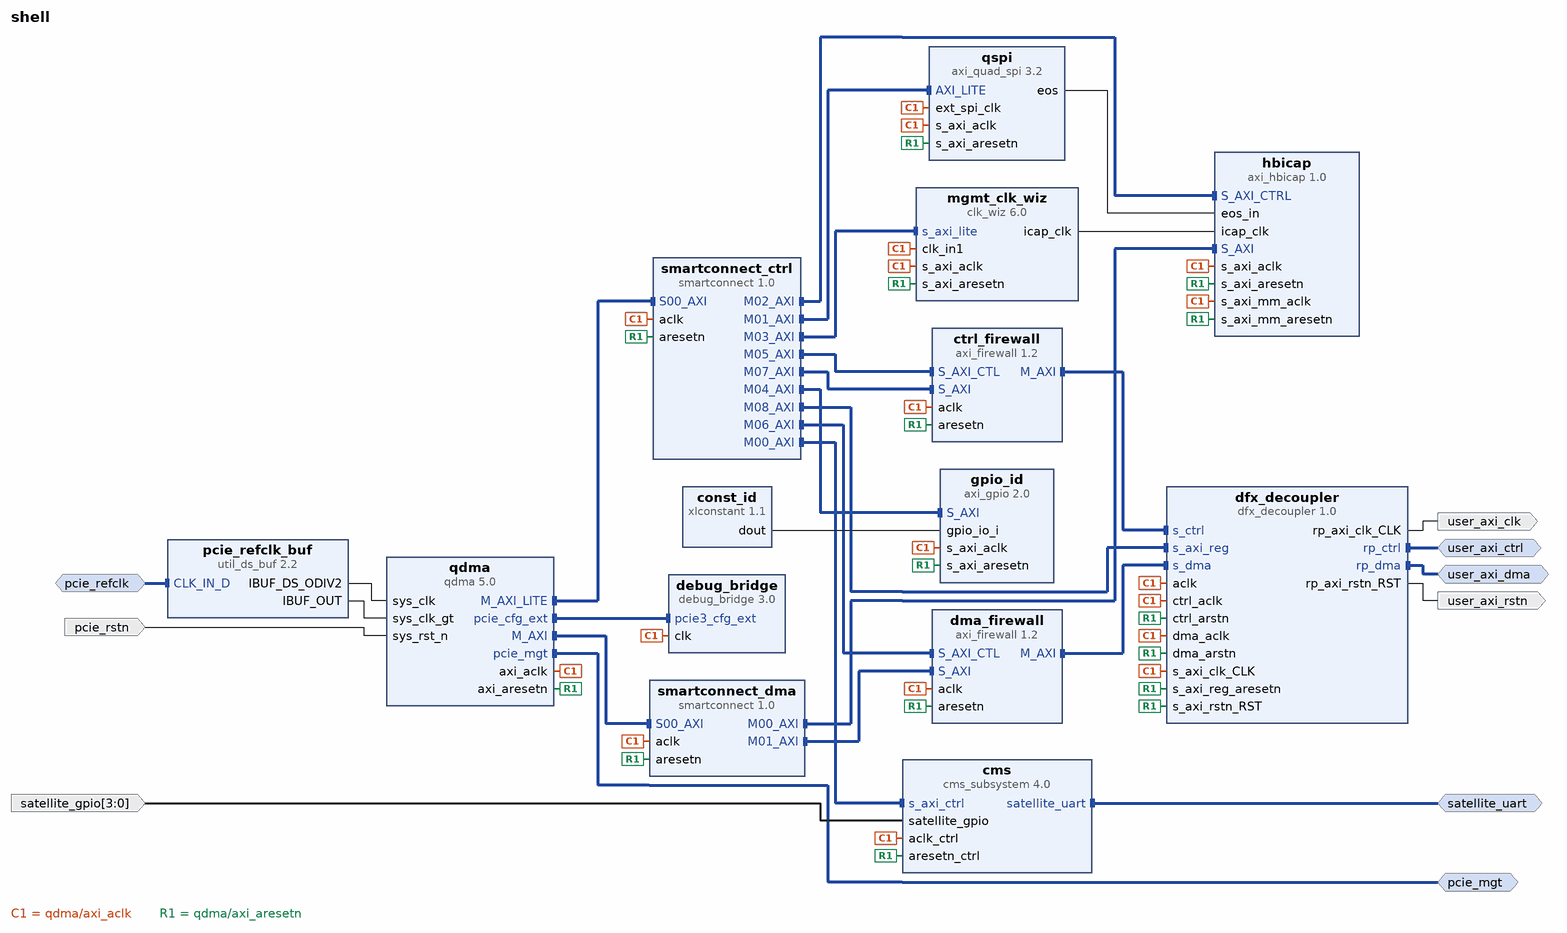
[diagram p0: block diagram of the top level]
# Vivado block design shell, xcu55n-fsvh2892-2L-e, Vivado 2022.2
create_bd_design shell

create_bd_intf_port -mode Master -vlnv xilinx.com:interface:pcie_7x_mgt_rtl:1.0 pcie_mgt
create_bd_intf_port -mode Slave -vlnv xilinx.com:interface:diff_clock_rtl:1.0 pcie_refclk
create_bd_intf_port -mode Master -vlnv xilinx.com:interface:uart_rtl:1.0 satellite_uart
create_bd_intf_port -mode Master -vlnv xilinx.com:interface:aximm_rtl:1.0 user_axi_ctrl
set_property -dict [list \
  CONFIG.ADDR_WIDTH 32 \
  CONFIG.DATA_WIDTH 32 \
  CONFIG.FREQ_HZ 250000000 \
  CONFIG.HAS_BURST 0 \
  CONFIG.HAS_CACHE 0 \
  CONFIG.HAS_LOCK 0 \
  CONFIG.HAS_PROT 0 \
  CONFIG.HAS_QOS 0 \
  CONFIG.HAS_REGION 0 \
  CONFIG.PROTOCOL AXI4LITE \
] [get_bd_intf_ports user_axi_ctrl]
create_bd_intf_port -mode Master -vlnv xilinx.com:interface:aximm_rtl:1.0 user_axi_dma
set_property -dict [list \
  CONFIG.ADDR_WIDTH 64 \
  CONFIG.DATA_WIDTH 128 \
  CONFIG.FREQ_HZ 250000000 \
  CONFIG.HAS_REGION 0 \
  CONFIG.NUM_READ_OUTSTANDING 32 \
  CONFIG.NUM_WRITE_OUTSTANDING 32 \
  CONFIG.PROTOCOL AXI4 \
] [get_bd_intf_ports user_axi_dma]
create_bd_port -dir I -type rst pcie_rstn
create_bd_port -dir I -from 3 -to 0 -type intr satellite_gpio
set_property -dict {CONFIG.PortWidth 4 CONFIG.SENSITIVITY EDGE_RISING} [get_bd_ports satellite_gpio]
create_bd_port -dir O -type clk user_axi_clk
set_property -dict {CONFIG.ASSOCIATED_RESET user_axi_rstn} [get_bd_ports user_axi_clk]
create_bd_port -dir O -type rst user_axi_rstn

create_bd_cell -type ip -vlnv xilinx.com:ip:cms_subsystem:4.0 cms
create_bd_cell -type ip -vlnv xilinx.com:ip:util_ds_buf:2.2 pcie_refclk_buf
set_property -dict {CONFIG.C_BUF_TYPE IBUFDSGTE} [get_bd_cells pcie_refclk_buf]
create_bd_cell -type ip -vlnv xilinx.com:ip:axi_quad_spi:3.2 qspi
set_property -dict [list \
  CONFIG.C_FIFO_DEPTH 256 \
  CONFIG.C_SPI_MEMORY 2 \
  CONFIG.C_SPI_MODE 2 \
  CONFIG.C_USE_STARTUP 1 \
  CONFIG.C_USE_STARTUP_INT 1 \
] [get_bd_cells qspi]
create_bd_cell -type ip -vlnv xilinx.com:ip:axi_hbicap:1.0 hbicap
set_property -dict {CONFIG.C_READ_PATH 0 CONFIG.C_WRITE_FIFO_DEPTH 1024} [get_bd_cells hbicap]
create_bd_cell -type ip -vlnv xilinx.com:ip:clk_wiz:6.0 mgmt_clk_wiz
set_property -dict [list \
  CONFIG.AUTO_PRIMITIVE MMCM \
  CONFIG.CLKOUT1_DRIVES Buffer \
  CONFIG.CLKOUT1_JITTER 106.624 \
  CONFIG.CLKOUT1_PHASE_ERROR 85.285 \
  CONFIG.CLKOUT1_REQUESTED_OUT_FREQ 125 \
  CONFIG.CLKOUT2_DRIVES Buffer \
  CONFIG.CLKOUT3_DRIVES Buffer \
  CONFIG.CLKOUT4_DRIVES Buffer \
  CONFIG.CLKOUT5_DRIVES Buffer \
  CONFIG.CLKOUT6_DRIVES Buffer \
  CONFIG.CLKOUT7_DRIVES Buffer \
  CONFIG.CLK_OUT1_PORT icap_clk \
  CONFIG.FEEDBACK_SOURCE FDBK_AUTO \
  CONFIG.MMCM_BANDWIDTH OPTIMIZED \
  CONFIG.MMCM_CLKFBOUT_MULT_F 9.625 \
  CONFIG.MMCM_CLKOUT0_DIVIDE_F 9.625 \
  CONFIG.MMCM_COMPENSATION AUTO \
  CONFIG.MMCM_DIVCLK_DIVIDE 2 \
  CONFIG.OPTIMIZE_CLOCKING_STRUCTURE_EN false \
  CONFIG.PRIMITIVE MMCM \
  CONFIG.PRIM_SOURCE Global_buffer \
  CONFIG.RESET_PORT reset \
  CONFIG.RESET_TYPE ACTIVE_HIGH \
  CONFIG.USE_DYN_RECONFIG true \
  CONFIG.USE_LOCKED true \
  CONFIG.USE_RESET true \
] [get_bd_cells mgmt_clk_wiz]
create_bd_cell -type ip -vlnv xilinx.com:ip:axi_gpio:2.0 gpio_id
set_property -dict {CONFIG.C_ALL_INPUTS 1 CONFIG.C_IS_DUAL 0} [get_bd_cells gpio_id]
create_bd_cell -type ip -vlnv xilinx.com:ip:xlconstant:1.1 const_id
set_property -dict {CONFIG.CONST_VAL 0xDEADBEEF CONFIG.CONST_WIDTH 32} [get_bd_cells const_id]
create_bd_cell -type ip -vlnv xilinx.com:ip:smartconnect:1.0 smartconnect_ctrl
set_property -dict {CONFIG.NUM_MI 9 CONFIG.NUM_SI 1} [get_bd_cells smartconnect_ctrl]
create_bd_cell -type ip -vlnv xilinx.com:ip:smartconnect:1.0 smartconnect_dma
set_property -dict {CONFIG.NUM_MI 2 CONFIG.NUM_SI 1} [get_bd_cells smartconnect_dma]
create_bd_cell -type ip -vlnv xilinx.com:ip:debug_bridge:3.0 debug_bridge
set_property -dict {CONFIG.C_DEBUG_MODE 5 CONFIG.C_DESIGN_TYPE 0} [get_bd_cells debug_bridge]
create_bd_cell -type ip -vlnv xilinx.com:ip:axi_firewall:1.2 dma_firewall
set_property -dict [list \
  CONFIG.ADDR_WIDTH 64 \
  CONFIG.ARUSER_WIDTH 0 \
  CONFIG.AWUSER_WIDTH 0 \
  CONFIG.BUSER_WIDTH 0 \
  CONFIG.DATA_WIDTH 128 \
  CONFIG.HAS_BRESP 1 \
  CONFIG.HAS_BURST 0 \
  CONFIG.HAS_CACHE 0 \
  CONFIG.HAS_LOCK 0 \
  CONFIG.HAS_PROT 0 \
  CONFIG.HAS_QOS 0 \
  CONFIG.HAS_REGION 0 \
  CONFIG.HAS_RRESP 1 \
  CONFIG.HAS_WSTRB 1 \
  CONFIG.ID_WIDTH 0 \
  CONFIG.PROTOCOL AXI4 \
  CONFIG.READ_WRITE_MODE READ_WRITE \
  CONFIG.RUSER_WIDTH 0 \
  CONFIG.SUPPORTS_NARROW 0 \
  CONFIG.WUSER_WIDTH 0 \
] [get_bd_cells dma_firewall]
create_bd_cell -type ip -vlnv xilinx.com:ip:axi_firewall:1.2 ctrl_firewall
set_property -dict [list \
  CONFIG.ADDR_WIDTH 32 \
  CONFIG.DATA_WIDTH 32 \
  CONFIG.HAS_BRESP 1 \
  CONFIG.HAS_BURST 0 \
  CONFIG.HAS_CACHE 0 \
  CONFIG.HAS_LOCK 0 \
  CONFIG.HAS_PROT 0 \
  CONFIG.HAS_QOS 0 \
  CONFIG.HAS_REGION 0 \
  CONFIG.HAS_RRESP 1 \
  CONFIG.HAS_WSTRB 1 \
  CONFIG.PROTOCOL AXI4LITE \
  CONFIG.READ_WRITE_MODE READ_WRITE \
  CONFIG.SUPPORTS_NARROW 0 \
] [get_bd_cells ctrl_firewall]
create_bd_cell -type ip -vlnv xilinx.com:ip:qdma:5.0 qdma
set_property -dict [list \
  CONFIG.cfg_ext_if true \
  CONFIG.copy_pf0 true \
  CONFIG.mcap_enablement DFX_over_PCIe \
  CONFIG.mode_selection Advanced \
  CONFIG.num_queues 512 \
  CONFIG.pf0_Use_Class_Code_Lookup_Assistant_qdma true \
  CONFIG.pf0_bar2_scale_qdma Megabytes \
  CONFIG.pf0_bar2_size_qdma 128 \
  CONFIG.pf0_base_class_menu_qdma Processing_accelerators \
  CONFIG.pf1_Use_Class_Code_Lookup_Assistant_qdma true \
  CONFIG.pf1_base_class_menu_qdma Processing_accelerators \
  CONFIG.pl_link_cap_max_link_speed 8.0_GT/s \
  CONFIG.pl_link_cap_max_link_width X4 \
  CONFIG.tl_pf_enable_reg 1 \
] [get_bd_cells qdma]
create_bd_cell -type ip -vlnv xilinx.com:ip:dfx_decoupler:1.0 dfx_decoupler
set_property -dict [list \
  CONFIG.ALL_PARAMS {['HAS_AXI_LITE 1', 'HAS_SIGNAL_CONTROL 0', 'HAS_SIGNAL_STATUS 1', 'ALWAYS_HAVE_AXI_CLK 1', 'INTF {', 'ctrl {ID 0 MODE slave VLNV xilinx.com:interface:aximm_rtl:1.0 PROTOCOL AXI4LITE SIGNALS {ARVALID {PRESENT 1 WIDTH 1} ARREADY {PRESENT 1 WIDTH 1} AWVALID {PRESENT 1 WIDTH 1} AWREADY {PRESENT 1 WIDTH 1}', 'BVALID {PRESENT 1 WIDTH 1} BREADY {PRESENT 1 WIDTH 1} RVALID {PRESENT 1 WIDTH 1} RREADY {PRESENT 1 WIDTH 1} WVALID {PRESENT 1 WIDTH 1} WREADY {PRESENT 1 WIDTH 1} AWADDR {PRESENT 1 WIDTH 32} AWLEN', '{PRESENT 0 WIDTH 8} AWSIZE {PRESENT 0 WIDTH 3} AWBURST {PRESENT 0 WIDTH 2} AWLOCK {PRESENT 0 WIDTH 1} AWCACHE {PRESENT 0 WIDTH 4} AWPROT {PRESENT 0 WIDTH 3} WDATA {PRESENT 1 WIDTH 32} WSTRB {PRESENT 1', 'WIDTH 4} WLAST {PRESENT 0 WIDTH 1} BRESP {PRESENT 1 WIDTH 2} ARADDR {PRESENT 1 WIDTH 32} ARLEN {PRESENT 0 WIDTH 8} ARSIZE {PRESENT 0 WIDTH 3} ARBURST {PRESENT 0 WIDTH 2} ARLOCK {PRESENT 0 WIDTH 1}', 'ARCACHE {PRESENT 0 WIDTH 4} ARPROT {PRESENT 0 WIDTH 3} RDATA {PRESENT 1 WIDTH 32} RRESP {PRESENT 1 WIDTH 2} RLAST {PRESENT 0 WIDTH 1} AWID {WIDTH 0 PRESENT 0} AWREGION {WIDTH 4 PRESENT 0} AWQOS {WIDTH', '4 PRESENT 0} AWUSER {WIDTH 0 PRESENT 0} WID {WIDTH 0 PRESENT 0} WUSER {WIDTH 0 PRESENT 0} BID {WIDTH 0 PRESENT 0} BUSER {WIDTH 0 PRESENT 0} ARID {WIDTH 0 PRESENT 0} ARREGION {WIDTH 4 PRESENT 0} ARQOS', '{WIDTH 4 PRESENT 0} ARUSER {WIDTH 0 PRESENT 0} RID {WIDTH 0 PRESENT 0} RUSER {WIDTH 0 PRESENT 0}}} dma {ID 1 MODE slave VLNV xilinx.com:interface:aximm_rtl:1.0 PROTOCOL AXI4 SIGNALS {ARVALID {WIDTH 1', 'PRESENT 1} ARREADY {WIDTH 1 PRESENT 1} AWVALID {WIDTH 1 PRESENT 1} AWREADY {WIDTH 1 PRESENT 1} BVALID {WIDTH 1 PRESENT 1} BREADY {WIDTH 1 PRESENT 1} RVALID {WIDTH 1 PRESENT 1} RREADY {WIDTH 1 PRESENT', '1} WVALID {WIDTH 1 PRESENT 1} WREADY {WIDTH 1 PRESENT 1} AWID {WIDTH 0 PRESENT 0} AWADDR {WIDTH 64 PRESENT 1} AWLEN {WIDTH 8 PRESENT 1} AWSIZE {WIDTH 3 PRESENT 1} AWBURST {WIDTH 2 PRESENT 0} AWLOCK', '{WIDTH 1 PRESENT 0} AWCACHE {WIDTH 4 PRESENT 0} AWPROT {WIDTH 3 PRESENT 0} AWREGION {WIDTH 4 PRESENT 0} AWQOS {WIDTH 4 PRESENT 0} AWUSER {WIDTH 0 PRESENT 0} WID {WIDTH 0 PRESENT 0} WDATA {WIDTH 128', 'PRESENT 1} WSTRB {WIDTH 16 PRESENT 1} WLAST {WIDTH 1 PRESENT 1} WUSER {WIDTH 0 PRESENT 0} BID {WIDTH 0 PRESENT 0} BRESP {WIDTH 2 PRESENT 1} BUSER {WIDTH 0 PRESENT 0} ARID {WIDTH 0 PRESENT 0} ARADDR', '{WIDTH 64 PRESENT 1} ARLEN {WIDTH 8 PRESENT 1} ARSIZE {WIDTH 3 PRESENT 1} ARBURST {WIDTH 2 PRESENT 0} ARLOCK {WIDTH 1 PRESENT 0} ARCACHE {WIDTH 4 PRESENT 0} ARPROT {WIDTH 3 PRESENT 0} ARREGION {WIDTH', '4 PRESENT 0} ARQOS {WIDTH 4 PRESENT 0} ARUSER {WIDTH 0 PRESENT 0} RID {WIDTH 0 PRESENT 0} RDATA {WIDTH 128 PRESENT 1} RRESP {WIDTH 2 PRESENT 1} RLAST {WIDTH 1 PRESENT 1} RUSER {WIDTH 0 PRESENT 0}}}', 'axi_clk {ID 2 VLNV xilinx.com:signal:clock_rtl:1.0 MODE slave SIGNALS {CLK {PRESENT 1 WIDTH 1}}} axi_rstn {ID 3 VLNV xilinx.com:signal:reset_rtl:1.0 MODE slave SIGNALS {RST {PRESENT 1 WIDTH 1}}}', '}', 'IPI_PROP_COUNT 3']} \
  CONFIG.GUI_INTERFACE_NAME ctrl \
  CONFIG.GUI_SELECT_MODE slave \
  CONFIG.GUI_SELECT_VLNV xilinx.com:interface:aximm_rtl:1.0 \
] [get_bd_cells dfx_decoupler]

# ---- connections ----

connect_bd_intf_net -intf_net CLK_IN_D_0_1 [get_bd_intf_ports pcie_refclk] [get_bd_intf_pins pcie_refclk_buf/CLK_IN_D]
connect_bd_intf_net [get_bd_intf_ports satellite_uart] [get_bd_intf_pins cms/satellite_uart]
connect_bd_intf_net [get_bd_intf_pins dfx_decoupler/s_ctrl] [get_bd_intf_pins ctrl_firewall/M_AXI]
connect_bd_intf_net [get_bd_intf_ports user_axi_ctrl] [get_bd_intf_pins dfx_decoupler/rp_ctrl]
connect_bd_intf_net [get_bd_intf_ports user_axi_dma] [get_bd_intf_pins dfx_decoupler/rp_dma]
connect_bd_intf_net [get_bd_intf_pins dfx_decoupler/s_dma] [get_bd_intf_pins dma_firewall/M_AXI]
connect_bd_intf_net [get_bd_intf_pins qdma/M_AXI] [get_bd_intf_pins smartconnect_dma/S00_AXI]
connect_bd_intf_net [get_bd_intf_pins qdma/M_AXI_LITE] [get_bd_intf_pins smartconnect_ctrl/S00_AXI]
connect_bd_intf_net [get_bd_intf_pins debug_bridge/pcie3_cfg_ext] [get_bd_intf_pins qdma/pcie_cfg_ext]
connect_bd_intf_net [get_bd_intf_ports pcie_mgt] [get_bd_intf_pins qdma/pcie_mgt]
connect_bd_intf_net [get_bd_intf_pins smartconnect_ctrl/M00_AXI] [get_bd_intf_pins cms/s_axi_ctrl]
connect_bd_intf_net [get_bd_intf_pins smartconnect_ctrl/M01_AXI] [get_bd_intf_pins qspi/AXI_LITE]
connect_bd_intf_net [get_bd_intf_pins smartconnect_ctrl/M02_AXI] [get_bd_intf_pins hbicap/S_AXI_CTRL]
connect_bd_intf_net [get_bd_intf_pins smartconnect_ctrl/M03_AXI] [get_bd_intf_pins mgmt_clk_wiz/s_axi_lite]
connect_bd_intf_net [get_bd_intf_pins smartconnect_ctrl/M04_AXI] [get_bd_intf_pins gpio_id/S_AXI]
connect_bd_intf_net [get_bd_intf_pins ctrl_firewall/S_AXI_CTL] [get_bd_intf_pins smartconnect_ctrl/M05_AXI]
connect_bd_intf_net [get_bd_intf_pins dma_firewall/S_AXI_CTL] [get_bd_intf_pins smartconnect_ctrl/M06_AXI]
connect_bd_intf_net [get_bd_intf_pins smartconnect_ctrl/M07_AXI] [get_bd_intf_pins ctrl_firewall/S_AXI]
connect_bd_intf_net [get_bd_intf_pins smartconnect_ctrl/M08_AXI] [get_bd_intf_pins dfx_decoupler/s_axi_reg]
connect_bd_intf_net [get_bd_intf_pins smartconnect_dma/M00_AXI] [get_bd_intf_pins hbicap/S_AXI]
connect_bd_intf_net [get_bd_intf_pins dma_firewall/S_AXI] [get_bd_intf_pins smartconnect_dma/M01_AXI]
connect_bd_net [get_bd_pins const_id/dout] [get_bd_pins gpio_id/gpio_io_i]
connect_bd_net [get_bd_pins dfx_decoupler/rp_axi_clk_CLK] [get_bd_ports user_axi_clk]
connect_bd_net [get_bd_pins dfx_decoupler/rp_axi_rstn_RST] [get_bd_ports user_axi_rstn]
connect_bd_net [get_bd_pins mgmt_clk_wiz/icap_clk] [get_bd_pins hbicap/icap_clk]
connect_bd_net -net pcie_ref_clk_buf_IBUF_DS_ODIV2 [get_bd_pins pcie_refclk_buf/IBUF_DS_ODIV2] [get_bd_pins qdma/sys_clk]
connect_bd_net -net pcie_ref_clk_buf_IBUF_OUT [get_bd_pins pcie_refclk_buf/IBUF_OUT] [get_bd_pins qdma/sys_clk_gt]
connect_bd_net [get_bd_ports pcie_rstn] [get_bd_pins qdma/sys_rst_n]
connect_bd_net [get_bd_pins qspi/eos] [get_bd_pins hbicap/eos_in]
connect_bd_net -net satellite_gpio_0_1 [get_bd_ports satellite_gpio] [get_bd_pins cms/satellite_gpio]
connect_bd_net -net xdma_axi_aclk [get_bd_pins qdma/axi_aclk] \
  [get_bd_pins cms/aclk_ctrl] [get_bd_pins qspi/ext_spi_clk] [get_bd_pins qspi/s_axi_aclk] [get_bd_pins mgmt_clk_wiz/clk_in1] \
  [get_bd_pins hbicap/s_axi_aclk] [get_bd_pins hbicap/s_axi_mm_aclk] [get_bd_pins mgmt_clk_wiz/s_axi_aclk] \
  [get_bd_pins gpio_id/s_axi_aclk] [get_bd_pins smartconnect_ctrl/aclk] [get_bd_pins smartconnect_dma/aclk] \
  [get_bd_pins debug_bridge/clk] [get_bd_pins ctrl_firewall/aclk] [get_bd_pins dfx_decoupler/aclk] \
  [get_bd_pins dma_firewall/aclk] [get_bd_pins dfx_decoupler/ctrl_aclk] [get_bd_pins dfx_decoupler/dma_aclk] \
  [get_bd_pins dfx_decoupler/s_axi_clk_CLK]
connect_bd_net -net xdma_axi_aresetn [get_bd_pins qdma/axi_aresetn] \
  [get_bd_pins cms/aresetn_ctrl] [get_bd_pins qspi/s_axi_aresetn] [get_bd_pins hbicap/s_axi_aresetn] \
  [get_bd_pins hbicap/s_axi_mm_aresetn] [get_bd_pins mgmt_clk_wiz/s_axi_aresetn] [get_bd_pins gpio_id/s_axi_aresetn] \
  [get_bd_pins smartconnect_ctrl/aresetn] [get_bd_pins smartconnect_dma/aresetn] [get_bd_pins ctrl_firewall/aresetn] \
  [get_bd_pins dfx_decoupler/s_axi_reg_aresetn] [get_bd_pins dma_firewall/aresetn] [get_bd_pins dfx_decoupler/ctrl_arstn] \
  [get_bd_pins dfx_decoupler/dma_arstn] [get_bd_pins dfx_decoupler/s_axi_rstn_RST]

# ---- address map ----
assign_bd_address -offset 0x0000000000000000 -range 256T -target_address_space [get_bd_addr_spaces qdma/M_AXI] [get_bd_addr_segs user_axi_dma/Reg]
assign_bd_address -offset 0xF000000000000000 -range 1G -target_address_space [get_bd_addr_spaces qdma/M_AXI] [get_bd_addr_segs hbicap/S_AXI/Mem0]
assign_bd_address -offset 0x00000000 -range 256K -target_address_space [get_bd_addr_spaces qdma/M_AXI_LITE] [get_bd_addr_segs cms/s_axi_ctrl/Mem]
assign_bd_address -offset 0x00040000 -range 64K -target_address_space [get_bd_addr_spaces qdma/M_AXI_LITE] [get_bd_addr_segs gpio_id/S_AXI/Reg]
assign_bd_address -offset 0x00050000 -range 64K -target_address_space [get_bd_addr_spaces qdma/M_AXI_LITE] [get_bd_addr_segs hbicap/S_AXI_CTRL/Reg0]
assign_bd_address -offset 0x00060000 -range 64K -target_address_space [get_bd_addr_spaces qdma/M_AXI_LITE] [get_bd_addr_segs mgmt_clk_wiz/s_axi_lite/Reg]
assign_bd_address -offset 0x00070000 -range 64K -target_address_space [get_bd_addr_spaces qdma/M_AXI_LITE] [get_bd_addr_segs qspi/AXI_LITE/Reg]
assign_bd_address -offset 0x00080000 -range 64K -target_address_space [get_bd_addr_spaces qdma/M_AXI_LITE] [get_bd_addr_segs ctrl_firewall/S_AXI_CTL/Control]
assign_bd_address -offset 0x00090000 -range 64K -target_address_space [get_bd_addr_spaces qdma/M_AXI_LITE] [get_bd_addr_segs dma_firewall/S_AXI_CTL/Control]
assign_bd_address -offset 0x00100000 -range 64K -target_address_space [get_bd_addr_spaces qdma/M_AXI_LITE] [get_bd_addr_segs dfx_decoupler/s_axi_reg/Reg]
assign_bd_address -offset 0x04000000 -range 64M -target_address_space [get_bd_addr_spaces qdma/M_AXI_LITE] [get_bd_addr_segs user_axi_ctrl/Reg]

validate_bd_design
save_bd_design
